# Altium schematic sheet WorkPart.SchDoc
size A4
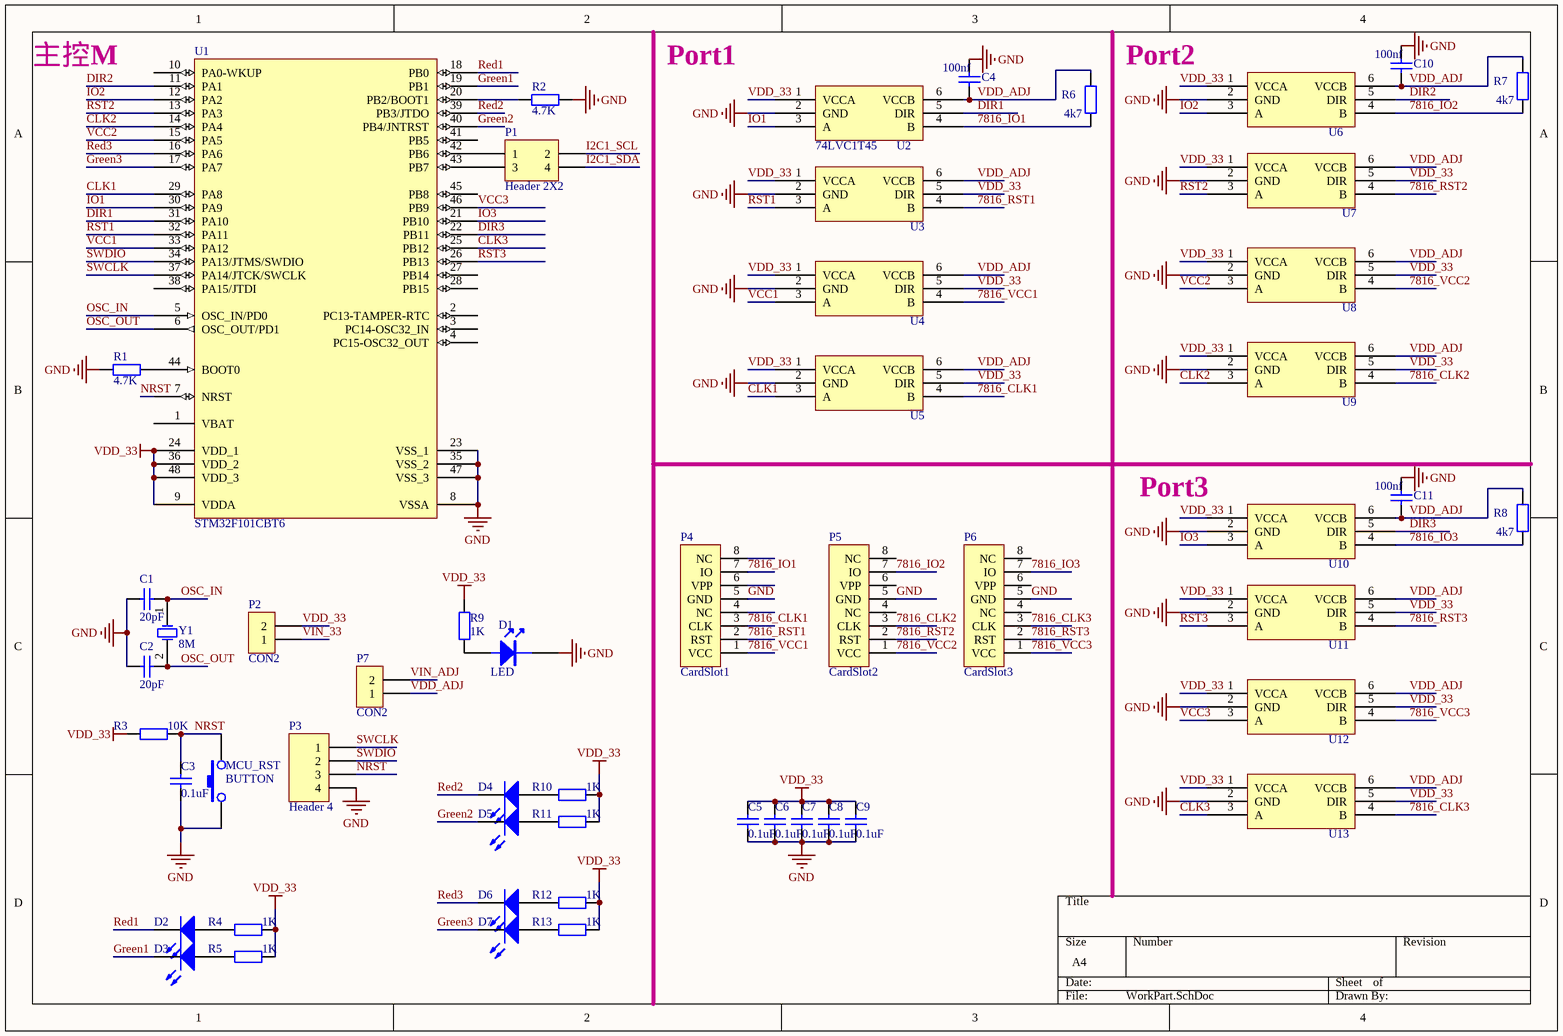
[diagram p0: WorkPart.SchDoc]

## Parts
C1  20pF  [0805]
C2  20pF  [0805]
C3  0.1uF  [0805]
C4  100nf  [0805]
C5  0.1uF  [0805]
C6  0.1uF  [0805]
C7  0.1uF  [0805]
C8  0.1uF  [0805]
C9  0.1uF  [0805]
C10  100nf  [0805]
C11  100nf  [0805]
D1  LED  [0805]
D2  LED2  [0805]  (value not drawn)
D3  LED2  [0805]  (value not drawn)
D4  LED2  [0805]  (value not drawn)
D5  LED2  [0805]  (value not drawn)
D6  LED2  [0805]  (value not drawn)
D7  LED2  [0805]  (value not drawn)
MCU_RST  BUTTON  [BUTTON-S]
P1  Header 2X2  [HDR2X2]
P2  CON2  [SIP2]
P3  Header 4  [SIP4]
P4  CardSlot1  [CardSlot]
P5  CardSlot2  [CardSlot]
P6  CardSlot3  [CardSlot]
P7  CON2  [SIP2]
R1  4.7K  [0805]
R2  4.7K  [0805]
R3  10K  [0805]
R4  1K  [0805]
R5  1K  [0805]
R6  4k7  [0805]
R7  4k7  [0805]
R8  4k7  [0805]
R9  1K  [0805]
R10  1K  [0805]
R11  1K  [0805]
R12  1K  [0805]
R13  1K  [0805]
U1  STM32F101CBT6  [LQFP48_N]
U2  74LVC1T45  [74LVC1T45]
U3  (no value)  [74LVC1T45]  (no BOM)
U4  (no value)  [74LVC1T45]  (no BOM)
U5  (no value)  [74LVC1T45]  (no BOM)
U6  (no value)  [74LVC1T45]  (no BOM)
U7  (no value)  [74LVC1T45]  (no BOM)
U8  (no value)  [74LVC1T45]  (no BOM)
U9  (no value)  [74LVC1T45]  (no BOM)
U10  (no value)  [74LVC1T45]  (no BOM)
U11  (no value)  [74LVC1T45]  (no BOM)
U12  (no value)  [74LVC1T45]  (no BOM)
U13  (no value)  [74LVC1T45]  (no BOM)
Y1  8M  [XTAL-0.2]

## Nets
GND: C1.2 C2.2 C3.1 C4.1 C5.1 C6.1 C7.1 C8.1 C9.1 C10.1 C11.1 D1.2(K) MCU_RST.1 P3.4 P4.5(GND) P5.5(GND) P6.5(GND) R1.2 R2.2 U1.8(VSSA) U1.23(VSS_1) U1.35(VSS_2) U1.47(VSS_3) U2.2(GND) U3.2(GND) U4.2(GND) U5.2(GND) U6.2(GND) U7.2(GND) U8.2(GND) U9.2(GND) U10.2(GND) U11.2(GND) U12.2(GND) U13.2(GND)
VDD_33: C5.2 C6.2 C7.2 C8.2 C9.2 P2.2 R3.1 R4.2 R5.1 R9.1 R10.2 R11.1 R12.2 R13.1 U1.9(VDDA) U1.24(VDD_1) U1.36(VDD_2) U1.48(VDD_3) U2.1(VCCA) U3.1(VCCA) U3.5(DIR) U4.1(VCCA) U4.5(DIR) U5.1(VCCA) U5.5(DIR) U6.1(VCCA) U7.1(VCCA) U7.5(DIR) U8.1(VCCA) U8.5(DIR) U9.1(VCCA) U9.5(DIR) U10.1(VCCA) U11.1(VCCA) U11.5(DIR) U12.1(VCCA) U12.5(DIR) U13.1(VCCA) U13.5(DIR)
7816_CLK1: P4.3(CLK) U5.4(B)
7816_CLK2: P5.3(CLK) U9.4(B)
7816_CLK3: P6.3(CLK) U13.4(B)
7816_IO1: P4.7(IO) R6.2 U2.4(B)
7816_IO2: P5.7(IO) R7.2 U6.4(B)
7816_IO3: P6.7(IO) R8.2 U10.4(B)
7816_RST1: P4.2(RST) U3.4(B)
7816_RST2: P5.2(RST) U7.4(B)
7816_RST3: P6.2(RST) U11.4(B)
7816_VCC1: P4.1(VCC) U4.4(B)
7816_VCC2: P5.1(VCC) U8.4(B)
7816_VCC3: P6.1(VCC) U12.4(B)
CLK1: U1.29(PA8) U5.3(A)
CLK2: U1.14(PA4) U9.3(A)
CLK3: U1.25(PB12) U13.3(A)
DIR1: U1.31(PA10) U2.5(DIR)
DIR2: U1.11(PA1) U6.5(DIR)
DIR3: U1.22(PB11) U10.5(DIR)
Green1: D3.2(K) U1.19(PB1)
Green2: D5.2(K) U1.40(PB4/JNTRST)
Green3: D7.2(K) U1.17(PA7)
I2C1_SCL: P1.2
I2C1_SDA: P1.4
IO1: U1.30(PA9) U2.3(A)
IO2: U1.12(PA2) U6.3(A)
IO3: U1.21(PB10) U10.3(A)
NRST: C3.2 MCU_RST.2 P3.3 R3.2 U1.7(NRST)
OSC_IN: C1.1 U1.5(OSC_IN/PD0) Y1.1(OSC1)
OSC_OUT: C2.1 U1.6(OSC_OUT/PD1) Y1.2(OSC2)
Red1: D2.2(K) U1.18(PB0)
Red2: D4.2(K) U1.39(PB3/JTDO)
Red3: D6.2(K) U1.16(PA6)
RST1: U1.32(PA11) U3.3(A)
RST2: U1.13(PA3) U7.3(A)
RST3: U1.26(PB13) U11.3(A)
SWCLK: P3.1 U1.37(PA14/JTCK/SWCLK)
SWDIO: P3.2 U1.34(PA13/JTMS/SWDIO)
VCC1: U1.33(PA12) U4.3(A)
VCC2: U1.15(PA5) U8.3(A)
VCC3: U1.46(PB9) U12.3(A)
VDD_ADJ: C4.2 C10.2 C11.2 P7.1 R6.1 R7.1 R8.1 U2.6(VCCB) U3.6(VCCB) U4.6(VCCB) U5.6(VCCB) U6.6(VCCB) U7.6(VCCB) U8.6(VCCB) U9.6(VCCB) U10.6(VCCB) U11.6(VCCB) U12.6(VCCB) U13.6(VCCB)
VIN_33: P2.1
VIN_ADJ: P7.2
NetD1_1: D1.1(A) R9.2
NetD2_1: D2.1(A) R4.1
NetD3_1: D3.1(A) R5.2
NetD4_1: D4.1(A) R10.1
NetD5_1: D5.1(A) R11.2
NetD6_1: D6.1(A) R12.1
NetD7_1: D7.1(A) R13.2
NetP1_1: P1.1 U1.42(PB6)
NetP1_3: P1.3 U1.43(PB7)
NetR1_1: R1.1 U1.44(BOOT0)
NetR2_1: R2.1 U1.20(PB2/BOOT1)

Not connected (* = marked no-connect by the designer): P4 4(NC) 6(VPP) 8(NC); P5 4(NC) 6(VPP) 8(NC); P6 4(NC) 6(VPP) 8(NC); U1 1(VBAT) 2(PC13-TAMPER-RTC) 3(PC14-OSC32_IN) 4(PC15-OSC32_OUT) 10(PA0-WKUP) 27(PB14) 28(PB15) 38(PA15/JTDI) 41(PB5) 45(PB8)

## Notes on the sheet
- 主控M
- Port1
- Port2
- (near U10) Port3

## Library data of the parts
C1-C3 C5-C9 = Cap: Capacitor; Published: 8-Jun-2000; LatestRevisionDate: 17-Jul-2002; LatestRevisionNote: Re-released for DXP Platform.; PackageReference: RAD-0.3; Publisher: Altium Limited
  C1 C2: Value: 20pF
  C3 C5-C9: Value: 0.1uF
C4 C10 C11 = C: 0805贴片电容
D2-D7 = LED2: Typical RED, GREEN, YELLOW, AMBER GaAs LED; Published: 8-Jun-2000; LatestRevisionDate: 17-Jul-2002; LatestRevisionNote: Re-released for DXP Platform.; PackageDocument: Feb-2002; PackageReference: 3.2X1.6X1.1; Publisher: Altium Limited
MCU_RST = BUTTON: 乒乓球按键（压下后接通，松开自动断开），较大按键尺寸12mmX12mm选用BUTTON-L封装，较小尺寸6mmX6mm选用BUTTON-S封装
P1 = Header 2X2: Header, 2-Pin, Dual row; LatestRevisionDate: 17-Jul-2002; LatestRevisionNote: Re-released for DXP Platform.; Publisher: Altium Limited
P2 P7 = CON2: Connector
P3 = Header 4: Header, 4-Pin; LatestRevisionDate: 17-Jul-2002; LatestRevisionNote: Re-released for DXP Platform.; Publisher: Altium Limited
P4-P6 = CardSlot
R1 R2 R6-R8 = R: 0603
R3-R5 R10-R13 = Res2: Resistor; Published: 8-Jun-2000; LatestRevisionDate: 17-Jul-2002; LatestRevisionNote: Re-released for DXP Platform.; PackageReference: 0805; Publisher: Altium Limited
  R3: Value: 10K
  R4 R5 R10-R13: Value: 1K
R9 = R: 0805
U1 = STM32F101CBT6: STM32 ARM-based 32-bit MCU with 128 Kbytes Flash, 48-pin LQFP, Industrial Temperature; Published: 30-May-2008; DatasheetVersion: rev6, Mar-2008; PackageVersion: Mar-2008; PackageReference: LQFP48; Publisher: Altium Limited; PackageDescription: 48-Pin Low-Profile Quad Flat Pack, 7 x 7 mm Body, 0.5 mm Pitch (LQFP48); ComponentLink1Description: Manufacturer Link; ComponentLink1URL: www.st.com/stm32; ComponentLink2Description: Datasheet; ComponentLink2URL: http://www.st.com/stonline/products/literature/ds/13586.pdf
U3-U13 = 74LVC1T45
Y1 = XTAL: Crystal Oscillator; Published: 8-Jun-2000; LatestRevisionDate: 17-Jul-2002; LatestRevisionNote: Re-released for DXP Platform.; PackageReference: XTAL-0.2; Publisher: Altium Limited